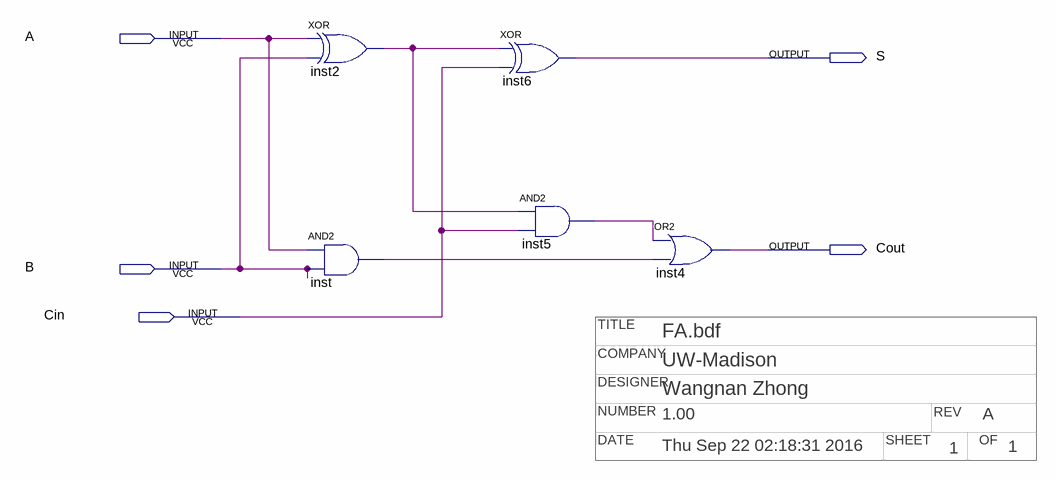
[diagram p0: schematic sheet]
// Quartus schematic fa.bdf as structural Verilog: 5 symbols, 5 pins
// Title block: COMPANY: UW-Madison; DATE: Thu Sep 22 02:18:31 2016; DESIGNER: Wangnan Zhong; NUMBER: 1.00; OF: 1; REV: A; SHEET: 1; TITLE: FA.bdf
module fa (
  input  A,
  input  B,
  input  Cin,
  output S,
  output Cout
);

  wire inst2_out, inst5_out, inst_out;

  xor inst2 (inst2_out, A, B);
  and inst (inst_out, A, B);
  xor inst6 (S, inst2_out, Cin);
  and inst5 (inst5_out, inst2_out, Cin);
  or inst4 (Cout, inst5_out, inst_out);
endmodule
